# Altium schematic sheet relay.SchDoc
size A3
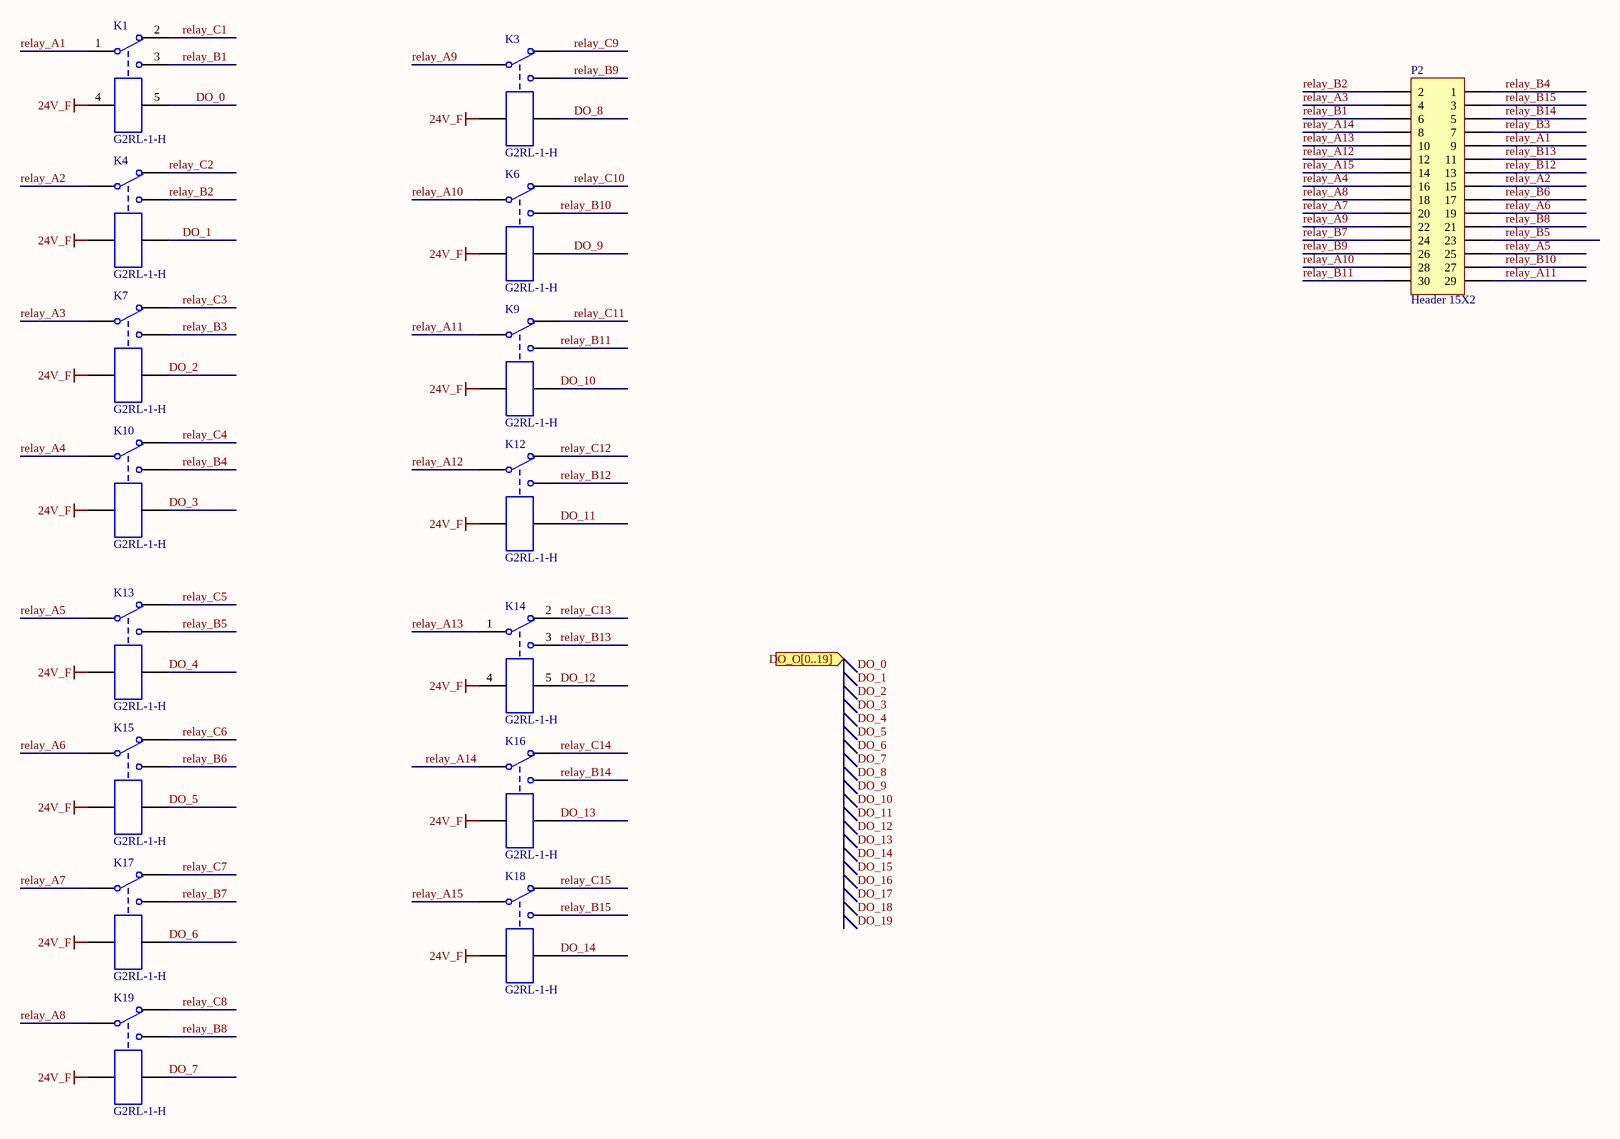
[diagram p0: relay.SchDoc]

## Parts
K1  G2RL-1-H  [G2RL-1-H]
K3  G2RL-1-H  [G2RL-1-H]
K4  G2RL-1-H  [G2RL-1-H]
K6  G2RL-1-H  [G2RL-1-H]
K7  G2RL-1-H  [G2RL-1-H]
K9  G2RL-1-H  [G2RL-1-H]
K10  G2RL-1-H  [G2RL-1-H]
K12  G2RL-1-H  [G2RL-1-H]
K13  G2RL-1-H  [G2RL-1-H]
K14  G2RL-1-H  [G2RL-1-H]
K15  G2RL-1-H  [G2RL-1-H]
K16  G2RL-1-H  [G2RL-1-H]
K17  G2RL-1-H  [G2RL-1-H]
K18  G2RL-1-H  [G2RL-1-H]
K19  G2RL-1-H  [G2RL-1-H]
P2  Header 15X2  [CONN-TH_30P-P2.50_KH-A2557-2X15A]

## Ports
DO_O[0..19] (in)

## Nets
24V_F: K1.4 K3.4 K4.4 K6.4 K7.4 K9.4 K10.4 K12.4 K13.4 K14.4 K15.4 K16.4 K17.4 K18.4 K19.4
DO_0: K1.5
DO_1: K4.5
DO_2: K7.5
DO_3: K10.5
DO_4: K13.5
DO_5: K15.5
DO_6: K17.5
DO_7: K19.5
DO_8: K3.5
DO_9: K6.5
DO_10: K9.5
DO_11: K12.5
DO_12: K14.5
DO_13: K16.5
DO_14: K18.5
relay_A1: K1.1 P2.9
relay_A2: K4.1 P2.15
relay_A3: K7.1 P2.4
relay_A4: K10.1 P2.16
relay_A5: K13.1 P2.25
relay_A6: K15.1 P2.19
relay_A7: K17.1 P2.20
relay_A8: K19.1 P2.18
relay_A9: K3.1 P2.22
relay_A10: K6.1 P2.28
relay_A11: K9.1 P2.29
relay_A12: K12.1 P2.12
relay_A13: K14.1 P2.10
relay_A14: K16.1 P2.8
relay_A15: K18.1 P2.14
relay_B1: K1.3 P2.6
relay_B2: K4.3 P2.2
relay_B3: K7.3 P2.7
relay_B4: K10.3 P2.1
relay_B5: K13.3 P2.23
relay_B6: K15.3 P2.17
relay_B7: K17.3 P2.24
relay_B8: K19.3 P2.21
relay_B9: K3.3 P2.26
relay_B10: K6.3 P2.27
relay_B11: K9.3 P2.30
relay_B12: K12.3 P2.13
relay_B13: K14.3 P2.11
relay_B14: K16.3 P2.5
relay_B15: K18.3 P2.3
relay_C1: K1.2
relay_C2: K4.2
relay_C3: K7.2
relay_C4: K10.2
relay_C5: K13.2
relay_C6: K15.2
relay_C7: K17.2
relay_C8: K19.2
relay_C9: K3.2
relay_C10: K6.2
relay_C11: K9.2
relay_C12: K12.2
relay_C13: K14.2
relay_C14: K16.2
relay_C15: K18.2

## Notes on the sheet
- Labels drawn without touching a wire or pin: DO_0, DO_1, DO_2, DO_3, DO_4, DO_5, DO_6, DO_7, DO_8, DO_9, DO_10, DO_11, DO_12, DO_13, DO_14, DO_15, DO_16, DO_17, DO_18, DO_19

## Library data of the parts
K1 K3 K4 K6 K7 K9 K10 K12-K19 = Relay-SPDT: Single-Pole Dual-Throw Relay; Published: 24-Mar-1999; LatestRevisionDate: 17-Jul-2002; LatestRevisionNote: Re-released for DXP Platform.; PackageReference: MODULE5B; Publisher: Altium Limited
P2 = Header 15X2: Header, 15-Pin, Dual row; LatestRevisionDate: 17-Jul-2002; LatestRevisionNote: Re-released for DXP Platform.; Publisher: Altium Limited